# EAGLE design template-apollo (EAGLE 9.3.0)
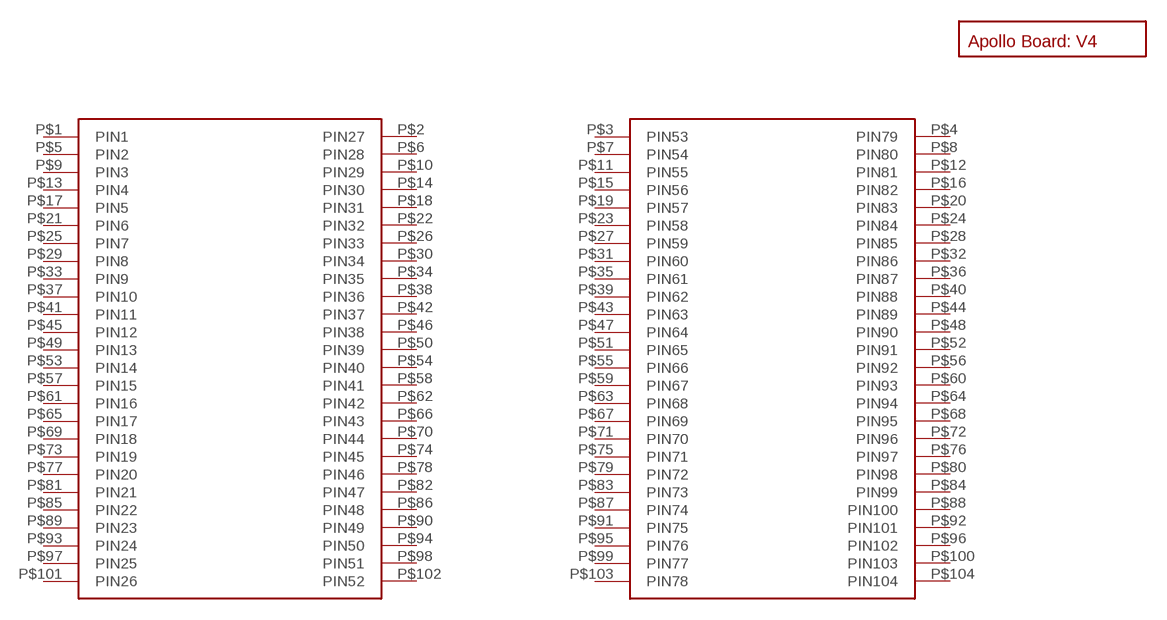
[diagram p0: schematic, sheet 1]

## Parts
U$1  BOARD_TEMPLATE1  [BOARD_TEMPLATE]
U$2  PC104_CONNECTOR  [PC104_CONNECTOR]
Unconnected: U$2.P$1(PIN1) U$2.P$2(PIN27) U$2.P$3(PIN53) U$2.P$4(PIN79) U$2.P$5(PIN2) U$2.P$6(PIN28) U$2.P$7(PIN54) U$2.P$8(PIN80) U$2.P$9(PIN3) U$2.P$10(PIN29) U$2.P$11(PIN55) U$2.P$12(PIN81) U$2.P$13(PIN4) U$2.P$14(PIN30) U$2.P$15(PIN56) U$2.P$16(PIN82) U$2.P$17(PIN5) U$2.P$18(PIN31) U$2.P$19(PIN57) U$2.P$20(PIN83) U$2.P$21(PIN6) U$2.P$22(PIN32) U$2.P$23(PIN58) U$2.P$24(PIN84) U$2.P$25(PIN7) U$2.P$26(PIN33) U$2.P$27(PIN59) U$2.P$28(PIN85) U$2.P$29(PIN8) U$2.P$30(PIN34) U$2.P$31(PIN60) U$2.P$32(PIN86) U$2.P$33(PIN9) U$2.P$34(PIN35) U$2.P$35(PIN61) U$2.P$36(PIN87) U$2.P$37(PIN10) U$2.P$38(PIN36) U$2.P$39(PIN62) U$2.P$40(PIN88) U$2.P$41(PIN11) U$2.P$42(PIN37) U$2.P$43(PIN63) U$2.P$44(PIN89) U$2.P$45(PIN12) U$2.P$46(PIN38) U$2.P$47(PIN64) U$2.P$48(PIN90) U$2.P$49(PIN13) U$2.P$50(PIN39) U$2.P$51(PIN65) U$2.P$52(PIN91) U$2.P$53(PIN14) U$2.P$54(PIN40) U$2.P$55(PIN66) U$2.P$56(PIN92) U$2.P$57(PIN15) U$2.P$58(PIN41) U$2.P$59(PIN67) U$2.P$60(PIN93) U$2.P$61(PIN16) U$2.P$62(PIN42) U$2.P$63(PIN68) U$2.P$64(PIN94) U$2.P$65(PIN17) U$2.P$66(PIN43) U$2.P$67(PIN69) U$2.P$68(PIN95) U$2.P$69(PIN18) U$2.P$70(PIN44) U$2.P$71(PIN70) U$2.P$72(PIN96) U$2.P$73(PIN19) U$2.P$74(PIN45) U$2.P$75(PIN71) U$2.P$76(PIN97) U$2.P$77(PIN20) U$2.P$78(PIN46) U$2.P$79(PIN72) U$2.P$80(PIN98) U$2.P$81(PIN21) U$2.P$82(PIN47) U$2.P$83(PIN73) U$2.P$84(PIN99) U$2.P$85(PIN22) U$2.P$86(PIN48) U$2.P$87(PIN74) U$2.P$88(PIN100) U$2.P$89(PIN23) U$2.P$90(PIN49) U$2.P$91(PIN75) U$2.P$92(PIN101) U$2.P$93(PIN24) U$2.P$94(PIN50) U$2.P$95(PIN76) U$2.P$96(PIN102) U$2.P$97(PIN25) U$2.P$98(PIN51) U$2.P$99(PIN77) U$2.P$100(PIN103) U$2.P$101(PIN26) U$2.P$102(PIN52) U$2.P$103(PIN78) U$2.P$104(PIN104)

## Library data of the parts
U$1 = template_board:BOARD_TEMPLATE
U$2 = template_board:PC104_CONNECTOR

## Net classes
0 default: clearance 0.152 mm
1 power: width 0.203 mm, drill 0.61 mm, clearance 0.152 mm
2 VIN: width 0.61 mm, drill 0.61 mm, clearance 0.152 mm to class 0, clearance 0.152 mm to class 1, clearance 0.152 mm
3 usbvcc: width 0.203 mm, drill 0.305 mm, clearance 0.152 mm to class 0, clearance 0.152 mm to class 1, clearance 0.152 mm to class 2, clearance 0.152 mm
4 diffpair: width 0.305 mm, drill 0.61 mm, clearance 0.305 mm to class 0, clearance 0.305 mm to class 1, clearance 0.305 mm to class 2, clearance 0.305 mm to class 3, clearance 0.152 mm

## Board
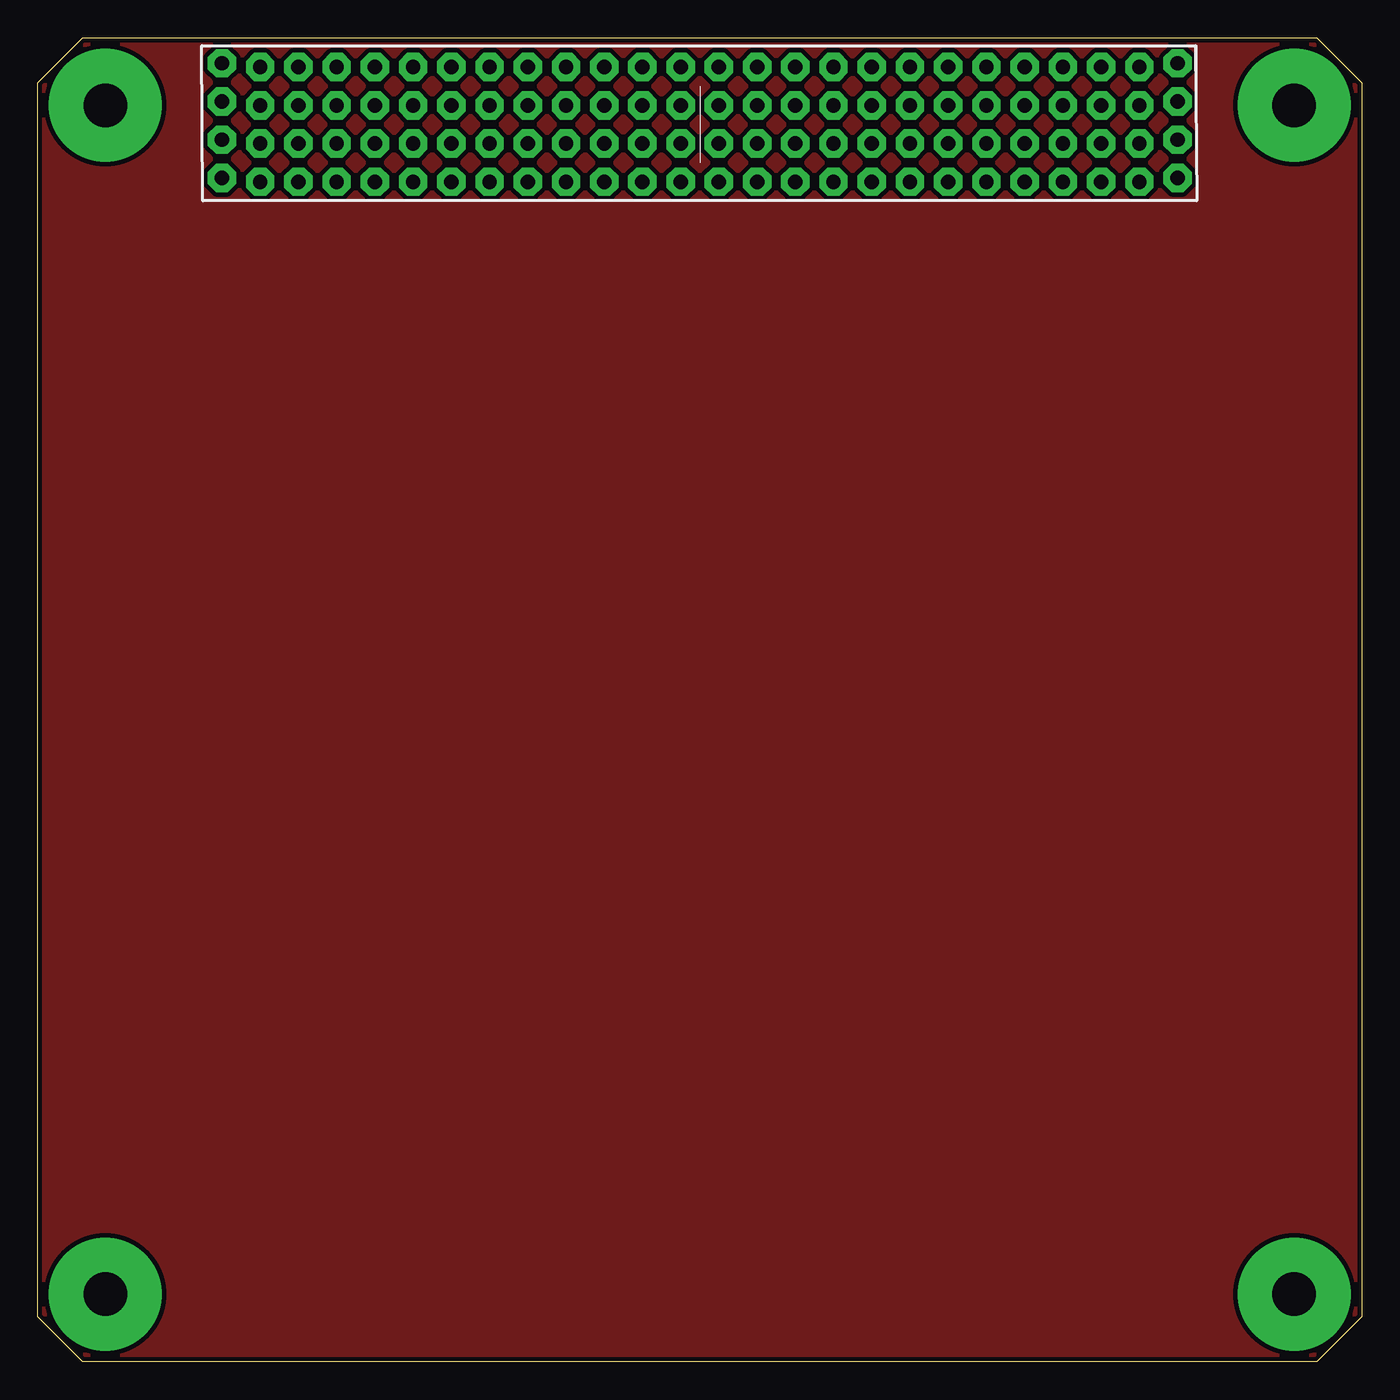
[diagram p1: board, top side]
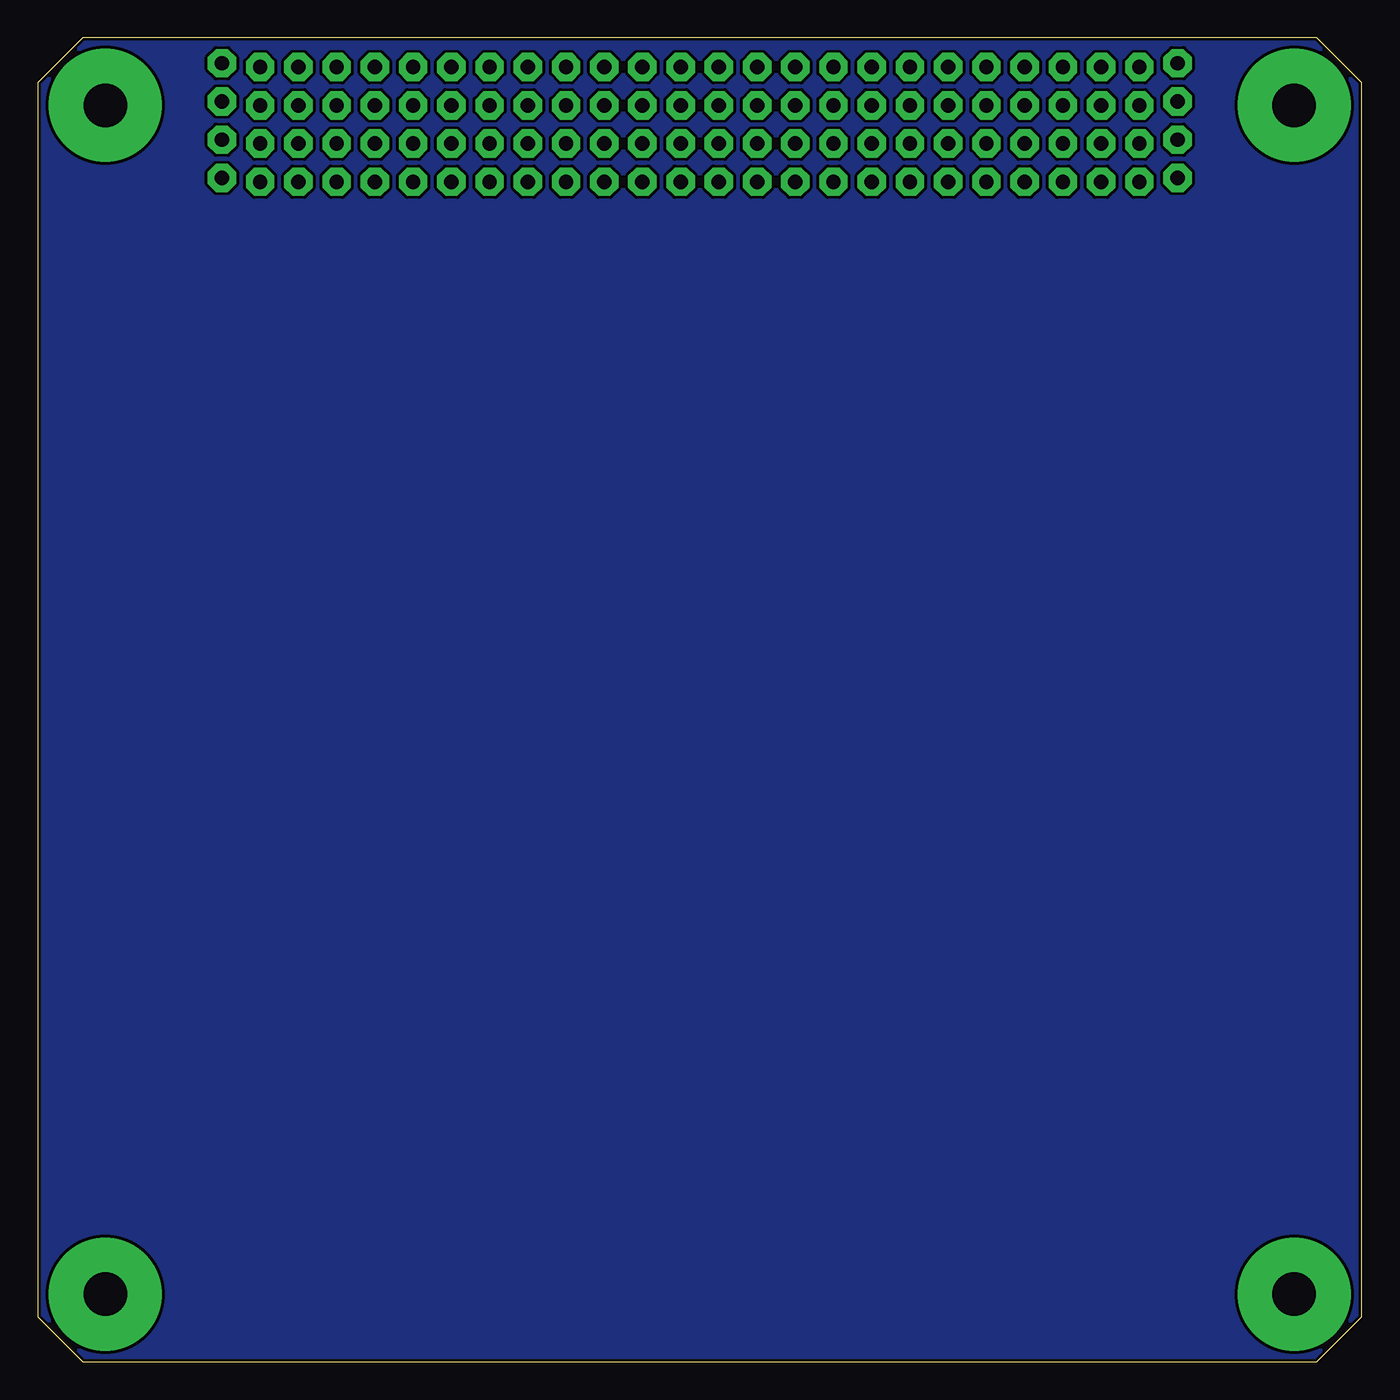
[diagram p2: board, bottom side, seen from below]

Size 88 x 88 mm. Coordinates in mm from the lower left corner, seen from the top.
Copper layers (1*16): Top 8mil / dielectric 8mil / Bottom 8mil
Design rules "default *": minimum track width 8mil, minimum drill 8mil, track to track 8mil, track to pad 8mil, pad to pad 8mil, via to via 8mil, smd to smd 8mil, copper to edge 8mil, drill to drill 8mil, minimum pad ring 10mil, minimum via ring 8mil, stop-mask expansion 4mil, vias tented up to drill 0mil, thermal gap 10mil

### Footprints (pad centres in the part's own frame; a part is rotated, then mirrored left to right if it is on the bottom)
BOARD_TEMPLATE = drill 2.9 pad 7.5: P$1 -39.5,39.5; P$2 -39.5,-39.5; P$3 39.5,-39.5; P$4 39.5,39.5
PC104_CONNECTOR = drill 0.953 pad 1.88 octagon: P$1 -31.75,34.674; P$2 -31.75,37.214; P$3 -31.75,39.754; P$4 -31.75,42.294; P$5 -29.21,34.42; P$6 -29.21,36.96; P$7 -29.21,39.5; P$8 -29.21,42.04; P$9 -26.67,34.42; P$10 -26.67,36.96; P$11 -26.67,39.5; P$12 -26.67,42.04; P$13 -24.13,34.42; P$14 -24.13,36.96; P$15 -24.13,39.5; P$16 -24.13,42.04; P$17 -21.59,34.42; P$18 -21.59,36.96; P$19 -21.59,39.5; P$20 -21.59,42.04; P$21 -19.05,34.42; P$22 -19.05,36.96; P$23 -19.05,39.5; P$24 -19.05,42.04; P$25 -16.51,34.42; P$26 -16.51,36.96; P$27 -16.51,39.5; P$28 -16.51,42.04; P$29 -13.97,34.42; P$30 -13.97,36.96; P$31 -13.97,39.5; P$32 -13.97,42.04; P$33 -11.43,34.42; P$34 -11.43,36.96; P$35 -11.43,39.5; P$36 -11.43,42.04; P$37 -8.89,34.42; P$38 -8.89,36.96; P$39 -8.89,39.5; P$40 -8.89,42.04; P$41 -6.35,34.42; P$42 -6.35,36.96; P$43 -6.35,39.5; P$44 -6.35,42.04; P$45 -3.81,34.42; P$46 -3.81,36.96; P$47 -3.81,39.5; P$48 -3.81,42.04; P$49 -1.27,34.42; P$50 -1.27,36.96; P$51 -1.27,39.5; P$52 -1.27,42.04; P$53 1.27,34.42; P$54 1.27,36.96; P$55 1.27,39.5; P$56 1.27,42.04; P$57 3.81,34.42; P$58 3.81,36.96; P$59 3.81,39.5; P$60 3.81,42.04; P$61 6.35,34.42; P$62 6.35,36.96; P$63 6.35,39.5; P$64 6.35,42.04; P$65 8.89,34.42; P$66 8.89,36.96; P$67 8.89,39.5; P$68 8.89,42.04; P$69 11.43,34.42; P$70 11.43,36.96; P$71 11.43,39.5; P$72 11.43,42.04; P$73 13.97,34.42; P$74 13.97,36.96; P$75 13.97,39.5; P$76 13.97,42.04; P$77 16.51,34.42; P$78 16.51,36.96; P$79 16.51,39.5; P$80 16.51,42.04; P$81 19.05,34.42; P$82 19.05,36.96; P$83 19.05,39.5; P$84 19.05,42.04; P$85 21.59,34.42; P$86 21.59,36.96; P$87 21.59,39.5; P$88 21.59,42.04; P$89 24.13,34.42; P$90 24.13,36.96; P$91 24.13,39.5; P$92 24.13,42.04; P$93 26.67,34.42; P$94 26.67,36.96; P$95 26.67,39.5; P$96 26.67,42.04; P$97 29.21,34.42; P$98 29.21,36.96; P$99 29.21,39.5; P$100 29.21,42.04; P$101 31.75,34.674; P$102 31.75,37.214; P$103 31.75,39.754; P$104 31.75,42.294

### Placement (x,y rotation side)
U$1  44,44 0 top
U$2  44,44 0 top

### Tracks (layer width: path | path; a pad name or v marks a point on that pad's centre or on a via)
GND
  pour Bottom (isolate 0.203): 3.06,87.87 84.95,87.87 87.87,84.95 87.87,3.05 84.98,0.16 3.06,0.13 0.14,3.05 0.14,84.95
  pour Top (isolate 0.305, rank 6): 3.06,0.13 0.14,3.05 0.14,84.95 3.05,87.87 84.95,87.87 87.87,84.94 87.87,3.05 84.95,0.13